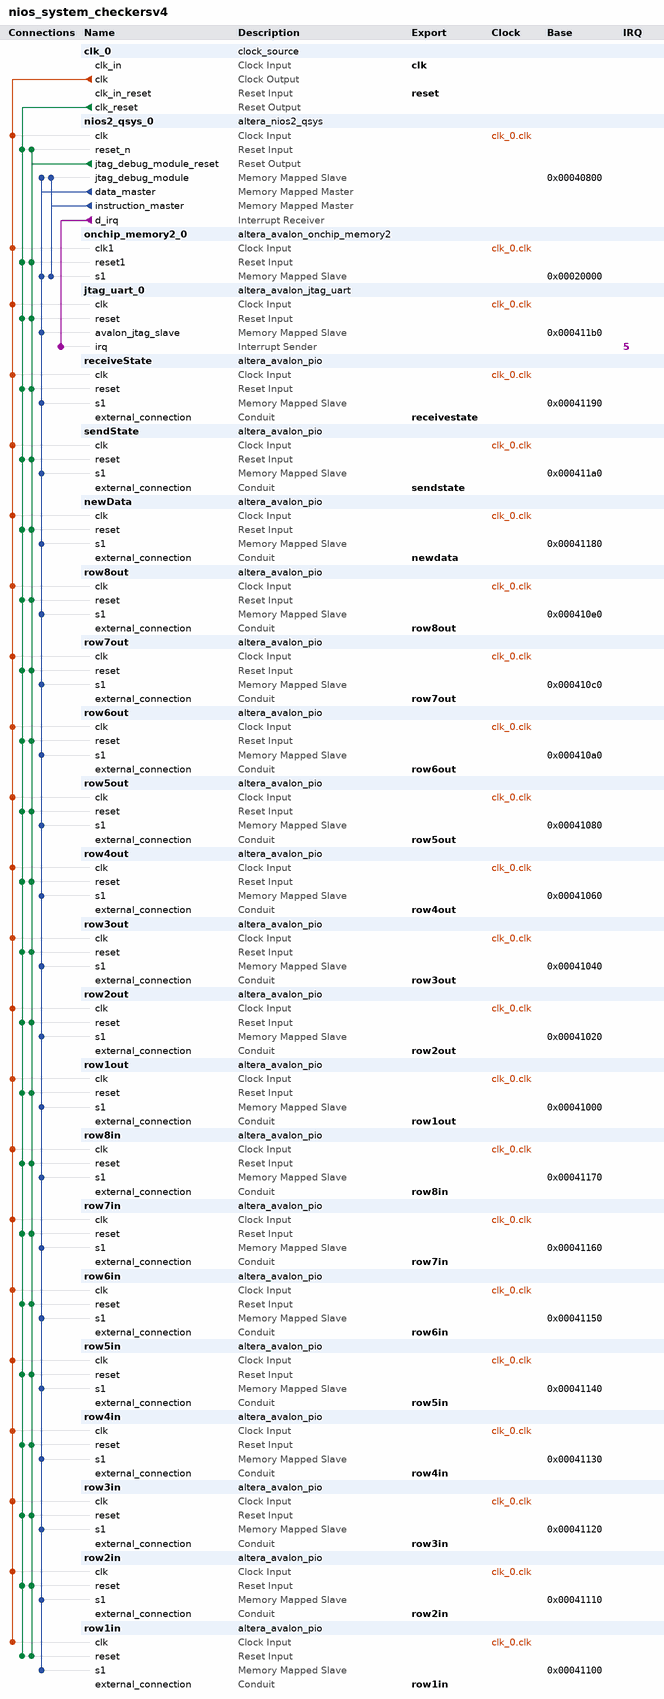
[diagram p0: system contents]
# Platform Designer (Qsys) system nios_system_checkersv4, Cyclone V 5CSEMA5F31C6
# Parameters at their usual value, and those the tool derives, are not listed.
package require -exact qsys 16.0
create_system nios_system_checkersv4
set_project_property DEVICE_FAMILY {Cyclone V}
set_project_property DEVICE 5CSEMA5F31C6

add_instance clk_0 clock_source 16.0
set_instance_parameter_value clk_0 clockFrequency 50000000

add_instance nios2_qsys_0 altera_nios2_qsys 16.0
set_instance_parameter_value nios2_qsys_0 breakSlave nios2_qsys_0.jtag_debug_module
set_instance_parameter_value nios2_qsys_0 exceptionSlave onchip_memory2_0.s1
set_instance_parameter_value nios2_qsys_0 icache_size 4096
set_instance_parameter_value nios2_qsys_0 impl Tiny
set_instance_parameter_value nios2_qsys_0 mmu_TLBMissExcSlave None
set_instance_parameter_value nios2_qsys_0 resetSlave onchip_memory2_0.s1
set_instance_parameter_value nios2_qsys_0 resetrequest_enabled true

add_instance onchip_memory2_0 altera_avalon_onchip_memory2 16.0
set_instance_parameter_value onchip_memory2_0 dataWidth 32
set_instance_parameter_value onchip_memory2_0 dualPort false
set_instance_parameter_value onchip_memory2_0 initMemContent true
set_instance_parameter_value onchip_memory2_0 initializationFileName onchip_mem.hex
set_instance_parameter_value onchip_memory2_0 memorySize 131072

add_instance jtag_uart_0 altera_avalon_jtag_uart 16.0
set_instance_parameter_value jtag_uart_0 simInteractiveOptions NO_INTERACTIVE_WINDOWS

add_instance receiveState altera_avalon_pio 16.0
set_instance_parameter_value receiveState direction Input
set_instance_parameter_value receiveState width 8

add_instance sendState altera_avalon_pio 16.0
set_instance_parameter_value sendState direction Output
set_instance_parameter_value sendState width 8

add_instance newData altera_avalon_pio 16.0
set_instance_parameter_value newData direction Input
set_instance_parameter_value newData width 8

add_instance row8out altera_avalon_pio 16.0
set_instance_parameter_value row8out bitModifyingOutReg true
set_instance_parameter_value row8out direction Output
set_instance_parameter_value row8out width 32

add_instance row7out altera_avalon_pio 16.0
set_instance_parameter_value row7out bitModifyingOutReg true
set_instance_parameter_value row7out direction Output
set_instance_parameter_value row7out width 32

add_instance row6out altera_avalon_pio 16.0
set_instance_parameter_value row6out bitModifyingOutReg true
set_instance_parameter_value row6out direction Output
set_instance_parameter_value row6out width 32

add_instance row5out altera_avalon_pio 16.0
set_instance_parameter_value row5out bitModifyingOutReg true
set_instance_parameter_value row5out direction Output
set_instance_parameter_value row5out width 32

add_instance row4out altera_avalon_pio 16.0
set_instance_parameter_value row4out bitModifyingOutReg true
set_instance_parameter_value row4out direction Output
set_instance_parameter_value row4out width 32

add_instance row3out altera_avalon_pio 16.0
set_instance_parameter_value row3out bitModifyingOutReg true
set_instance_parameter_value row3out direction Output
set_instance_parameter_value row3out width 32

add_instance row2out altera_avalon_pio 16.0
set_instance_parameter_value row2out bitModifyingOutReg true
set_instance_parameter_value row2out direction Output
set_instance_parameter_value row2out width 32

add_instance row1out altera_avalon_pio 16.0
set_instance_parameter_value row1out bitModifyingOutReg true
set_instance_parameter_value row1out direction Output
set_instance_parameter_value row1out width 32

add_instance row8in altera_avalon_pio 16.0
set_instance_parameter_value row8in direction Input
set_instance_parameter_value row8in width 32

add_instance row7in altera_avalon_pio 16.0
set_instance_parameter_value row7in direction Input
set_instance_parameter_value row7in width 32

add_instance row6in altera_avalon_pio 16.0
set_instance_parameter_value row6in direction Input
set_instance_parameter_value row6in width 32

add_instance row5in altera_avalon_pio 16.0
set_instance_parameter_value row5in direction Input
set_instance_parameter_value row5in width 32

add_instance row4in altera_avalon_pio 16.0
set_instance_parameter_value row4in direction Input
set_instance_parameter_value row4in width 32

add_instance row3in altera_avalon_pio 16.0
set_instance_parameter_value row3in direction Input
set_instance_parameter_value row3in width 32

add_instance row2in altera_avalon_pio 16.0
set_instance_parameter_value row2in direction Input
set_instance_parameter_value row2in width 32

add_instance row1in altera_avalon_pio 16.0
set_instance_parameter_value row1in direction Input
set_instance_parameter_value row1in width 32

# connections
add_connection clk_0.clk jtag_uart_0.clk clock
add_connection clk_0.clk newData.clk clock
add_connection clk_0.clk nios2_qsys_0.clk clock
add_connection clk_0.clk onchip_memory2_0.clk1 clock
add_connection clk_0.clk receiveState.clk clock
add_connection clk_0.clk row1in.clk clock
add_connection clk_0.clk row1out.clk clock
add_connection clk_0.clk row2in.clk clock
add_connection clk_0.clk row2out.clk clock
add_connection clk_0.clk row3in.clk clock
add_connection clk_0.clk row3out.clk clock
add_connection clk_0.clk row4in.clk clock
add_connection clk_0.clk row4out.clk clock
add_connection clk_0.clk row5in.clk clock
add_connection clk_0.clk row5out.clk clock
add_connection clk_0.clk row6in.clk clock
add_connection clk_0.clk row6out.clk clock
add_connection clk_0.clk row7in.clk clock
add_connection clk_0.clk row7out.clk clock
add_connection clk_0.clk row8in.clk clock
add_connection clk_0.clk row8out.clk clock
add_connection clk_0.clk sendState.clk clock
add_connection clk_0.clk_reset jtag_uart_0.reset reset
add_connection clk_0.clk_reset newData.reset reset
add_connection clk_0.clk_reset nios2_qsys_0.reset_n reset
add_connection clk_0.clk_reset onchip_memory2_0.reset1 reset
add_connection clk_0.clk_reset receiveState.reset reset
add_connection clk_0.clk_reset row1in.reset reset
add_connection clk_0.clk_reset row1out.reset reset
add_connection clk_0.clk_reset row2in.reset reset
add_connection clk_0.clk_reset row2out.reset reset
add_connection clk_0.clk_reset row3in.reset reset
add_connection clk_0.clk_reset row3out.reset reset
add_connection clk_0.clk_reset row4in.reset reset
add_connection clk_0.clk_reset row4out.reset reset
add_connection clk_0.clk_reset row5in.reset reset
add_connection clk_0.clk_reset row5out.reset reset
add_connection clk_0.clk_reset row6in.reset reset
add_connection clk_0.clk_reset row6out.reset reset
add_connection clk_0.clk_reset row7in.reset reset
add_connection clk_0.clk_reset row7out.reset reset
add_connection clk_0.clk_reset row8in.reset reset
add_connection clk_0.clk_reset row8out.reset reset
add_connection clk_0.clk_reset sendState.reset reset
add_connection nios2_qsys_0.jtag_debug_module_reset jtag_uart_0.reset reset
add_connection nios2_qsys_0.jtag_debug_module_reset newData.reset reset
add_connection nios2_qsys_0.jtag_debug_module_reset nios2_qsys_0.reset_n reset
add_connection nios2_qsys_0.jtag_debug_module_reset onchip_memory2_0.reset1 reset
add_connection nios2_qsys_0.jtag_debug_module_reset receiveState.reset reset
add_connection nios2_qsys_0.jtag_debug_module_reset row1in.reset reset
add_connection nios2_qsys_0.jtag_debug_module_reset row1out.reset reset
add_connection nios2_qsys_0.jtag_debug_module_reset row2in.reset reset
add_connection nios2_qsys_0.jtag_debug_module_reset row2out.reset reset
add_connection nios2_qsys_0.jtag_debug_module_reset row3in.reset reset
add_connection nios2_qsys_0.jtag_debug_module_reset row3out.reset reset
add_connection nios2_qsys_0.jtag_debug_module_reset row4in.reset reset
add_connection nios2_qsys_0.jtag_debug_module_reset row4out.reset reset
add_connection nios2_qsys_0.jtag_debug_module_reset row5in.reset reset
add_connection nios2_qsys_0.jtag_debug_module_reset row5out.reset reset
add_connection nios2_qsys_0.jtag_debug_module_reset row6in.reset reset
add_connection nios2_qsys_0.jtag_debug_module_reset row6out.reset reset
add_connection nios2_qsys_0.jtag_debug_module_reset row7in.reset reset
add_connection nios2_qsys_0.jtag_debug_module_reset row7out.reset reset
add_connection nios2_qsys_0.jtag_debug_module_reset row8in.reset reset
add_connection nios2_qsys_0.jtag_debug_module_reset row8out.reset reset
add_connection nios2_qsys_0.jtag_debug_module_reset sendState.reset reset
add_connection nios2_qsys_0.data_master jtag_uart_0.avalon_jtag_slave avalon
set_connection_parameter_value nios2_qsys_0.data_master/jtag_uart_0.avalon_jtag_slave baseAddress 0x000411b0
add_connection nios2_qsys_0.data_master newData.s1 avalon
set_connection_parameter_value nios2_qsys_0.data_master/newData.s1 baseAddress 0x00041180
add_connection nios2_qsys_0.data_master nios2_qsys_0.jtag_debug_module avalon
set_connection_parameter_value nios2_qsys_0.data_master/nios2_qsys_0.jtag_debug_module baseAddress 0x00040800
add_connection nios2_qsys_0.data_master onchip_memory2_0.s1 avalon
set_connection_parameter_value nios2_qsys_0.data_master/onchip_memory2_0.s1 baseAddress 0x00020000
add_connection nios2_qsys_0.data_master receiveState.s1 avalon
set_connection_parameter_value nios2_qsys_0.data_master/receiveState.s1 baseAddress 0x00041190
add_connection nios2_qsys_0.data_master row1in.s1 avalon
set_connection_parameter_value nios2_qsys_0.data_master/row1in.s1 baseAddress 0x00041100
add_connection nios2_qsys_0.data_master row1out.s1 avalon
set_connection_parameter_value nios2_qsys_0.data_master/row1out.s1 baseAddress 0x00041000
add_connection nios2_qsys_0.data_master row2in.s1 avalon
set_connection_parameter_value nios2_qsys_0.data_master/row2in.s1 baseAddress 0x00041110
add_connection nios2_qsys_0.data_master row2out.s1 avalon
set_connection_parameter_value nios2_qsys_0.data_master/row2out.s1 baseAddress 0x00041020
add_connection nios2_qsys_0.data_master row3in.s1 avalon
set_connection_parameter_value nios2_qsys_0.data_master/row3in.s1 baseAddress 0x00041120
add_connection nios2_qsys_0.data_master row3out.s1 avalon
set_connection_parameter_value nios2_qsys_0.data_master/row3out.s1 baseAddress 0x00041040
add_connection nios2_qsys_0.data_master row4in.s1 avalon
set_connection_parameter_value nios2_qsys_0.data_master/row4in.s1 baseAddress 0x00041130
add_connection nios2_qsys_0.data_master row4out.s1 avalon
set_connection_parameter_value nios2_qsys_0.data_master/row4out.s1 baseAddress 0x00041060
add_connection nios2_qsys_0.data_master row5in.s1 avalon
set_connection_parameter_value nios2_qsys_0.data_master/row5in.s1 baseAddress 0x00041140
add_connection nios2_qsys_0.data_master row5out.s1 avalon
set_connection_parameter_value nios2_qsys_0.data_master/row5out.s1 baseAddress 0x00041080
add_connection nios2_qsys_0.data_master row6in.s1 avalon
set_connection_parameter_value nios2_qsys_0.data_master/row6in.s1 baseAddress 0x00041150
add_connection nios2_qsys_0.data_master row6out.s1 avalon
set_connection_parameter_value nios2_qsys_0.data_master/row6out.s1 baseAddress 0x000410a0
add_connection nios2_qsys_0.data_master row7in.s1 avalon
set_connection_parameter_value nios2_qsys_0.data_master/row7in.s1 baseAddress 0x00041160
add_connection nios2_qsys_0.data_master row7out.s1 avalon
set_connection_parameter_value nios2_qsys_0.data_master/row7out.s1 baseAddress 0x000410c0
add_connection nios2_qsys_0.data_master row8in.s1 avalon
set_connection_parameter_value nios2_qsys_0.data_master/row8in.s1 baseAddress 0x00041170
add_connection nios2_qsys_0.data_master row8out.s1 avalon
set_connection_parameter_value nios2_qsys_0.data_master/row8out.s1 baseAddress 0x000410e0
add_connection nios2_qsys_0.data_master sendState.s1 avalon
set_connection_parameter_value nios2_qsys_0.data_master/sendState.s1 baseAddress 0x000411a0
add_connection nios2_qsys_0.instruction_master nios2_qsys_0.jtag_debug_module avalon
set_connection_parameter_value nios2_qsys_0.instruction_master/nios2_qsys_0.jtag_debug_module baseAddress 0x00040800
add_connection nios2_qsys_0.instruction_master onchip_memory2_0.s1 avalon
set_connection_parameter_value nios2_qsys_0.instruction_master/onchip_memory2_0.s1 baseAddress 0x00020000
add_connection nios2_qsys_0.d_irq jtag_uart_0.irq interrupt
set_connection_parameter_value nios2_qsys_0.d_irq/jtag_uart_0.irq irqNumber 5

# exported interfaces
add_interface clk clock sink
set_interface_property clk EXPORT_OF clk_0.clk_in
add_interface newdata conduit end
set_interface_property newdata EXPORT_OF newData.external_connection
add_interface receivestate conduit end
set_interface_property receivestate EXPORT_OF receiveState.external_connection
add_interface reset reset sink
set_interface_property reset EXPORT_OF clk_0.clk_in_reset
add_interface row1in conduit end
set_interface_property row1in EXPORT_OF row1in.external_connection
add_interface row1out conduit end
set_interface_property row1out EXPORT_OF row1out.external_connection
add_interface row2in conduit end
set_interface_property row2in EXPORT_OF row2in.external_connection
add_interface row2out conduit end
set_interface_property row2out EXPORT_OF row2out.external_connection
add_interface row3in conduit end
set_interface_property row3in EXPORT_OF row3in.external_connection
add_interface row3out conduit end
set_interface_property row3out EXPORT_OF row3out.external_connection
add_interface row4in conduit end
set_interface_property row4in EXPORT_OF row4in.external_connection
add_interface row4out conduit end
set_interface_property row4out EXPORT_OF row4out.external_connection
add_interface row5in conduit end
set_interface_property row5in EXPORT_OF row5in.external_connection
add_interface row5out conduit end
set_interface_property row5out EXPORT_OF row5out.external_connection
add_interface row6in conduit end
set_interface_property row6in EXPORT_OF row6in.external_connection
add_interface row6out conduit end
set_interface_property row6out EXPORT_OF row6out.external_connection
add_interface row7in conduit end
set_interface_property row7in EXPORT_OF row7in.external_connection
add_interface row7out conduit end
set_interface_property row7out EXPORT_OF row7out.external_connection
add_interface row8in conduit end
set_interface_property row8in EXPORT_OF row8in.external_connection
add_interface row8out conduit end
set_interface_property row8out EXPORT_OF row8out.external_connection
add_interface sendstate conduit end
set_interface_property sendstate EXPORT_OF sendState.external_connection

set_interconnect_requirement {$system} qsys_mm.clockCrossingAdapter HANDSHAKE
set_interconnect_requirement {$system} qsys_mm.enableEccProtection FALSE
set_interconnect_requirement {$system} qsys_mm.insertDefaultSlave FALSE
set_interconnect_requirement {$system} qsys_mm.maxAdditionalLatency 1

save_system nios_system_checkersv4.qsys
